# Altium project Proco RAT R1.PrjPcb
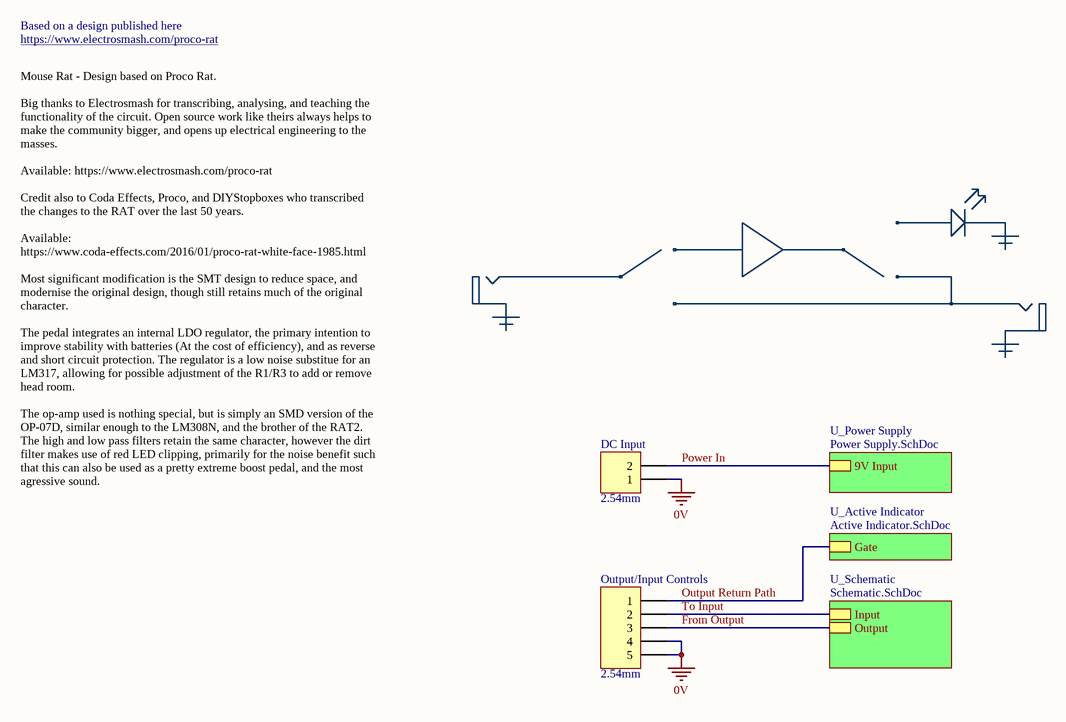
[diagram p0: Top Level.SchDoc]
4 sheets, 47 parts. Net scope: hierarchical (ports join the sheet entries above them; power ports are global).
Board file: PCB.PcbDoc
Sheets:
  Top Level.SchDoc
    U_Power Supply = Power Supply.SchDoc
    U_Schematic = Schematic.SchDoc
    U_Active Indicator = Active Indicator.SchDoc

## Sheet Top Level.SchDoc
size A4

### Parts
DC_Input  2.54mm  [TH 2.54mm Header 1x2]
Output/Input_Controls  2.54mm  [TH 2.54mm Header 1x5]

### Sub-sheets
U_Active Indicator = Active Indicator.SchDoc: Gate
U_Power Supply = Power Supply.SchDoc: 9V Input
U_Schematic = Schematic.SchDoc: Output, Input

### Nets
0V: DC_Input.1 Output/Input_Controls.4 Output/Input_Controls.5
From Output: Output/Input_Controls.3 ; sheet U_Schematic/Output
Output Return Path: Output/Input_Controls.1 ; sheet U_Active Indicator/Gate
Power In: DC_Input.2 ; sheet U_Power Supply/9V Input
To Input: Output/Input_Controls.2 ; sheet U_Schematic/Input

### Notes on the sheet
- https://www.electrosmash.com/proco-rat
- Based on a design published here
- Mouse Rat - Design based on Proco Rat.
  Big thanks to Electrosmash for transcribing, analysing, and teaching the functionality of the circuit. Open source work like theirs always helps to make the community bigger, and opens up electrical engineering to the masses.
  Available: https://www.electrosmash.com/proco-rat
  Credit also to Coda Effects, Proco, and DIYStopboxes who transcribed the changes to the RAT over the last 50 years.
  Available: https://www.coda-effects.com/2016/01/proco-rat-white-face-1985.html
  Most significant modification is the SMT design to reduce space, and modernise the original design, though still retains much of the original character.
  The pedal integrates an internal LDO regulator, the primary intention to improve stability with batteries (At the cost of efficiency), and as reverse and short circuit protection. The regulator is a low noise substitue for an LM317, allowing for possible adjustment of the R1/R3 to add or remove head room.
  The op-amp used is nothing special, but is simply an SMD version of the OP-07D, similar enough to the LM308N, and the brother of the RAT2. The high and low pass filters retain the same character, however the dirt filter makes use of red LED clipping, primarily for the noise benefit such that this can also be used as a pretty extreme boost pedal, and the most agressive sound.

### Library data of the parts
DC_Input = TH 2.54mm Header 1x2: Positions: 2; Angle: 0; Flange: No; Contact: NA; Part Number: TH 2.54mm Header 1x2; Pitch: 2.54mm; Row Spacing: 2.54mm
Output/Input_Controls = TH 2.54mm Header 1x5: Positions: 5; Angle: 0; Flange: No; Contact: NA; Part Number: TH 2.54mm Header 1x5; Pitch: 2.54mm; Row Spacing: 2.54mm

## Sheet Power Supply.SchDoc
size A4
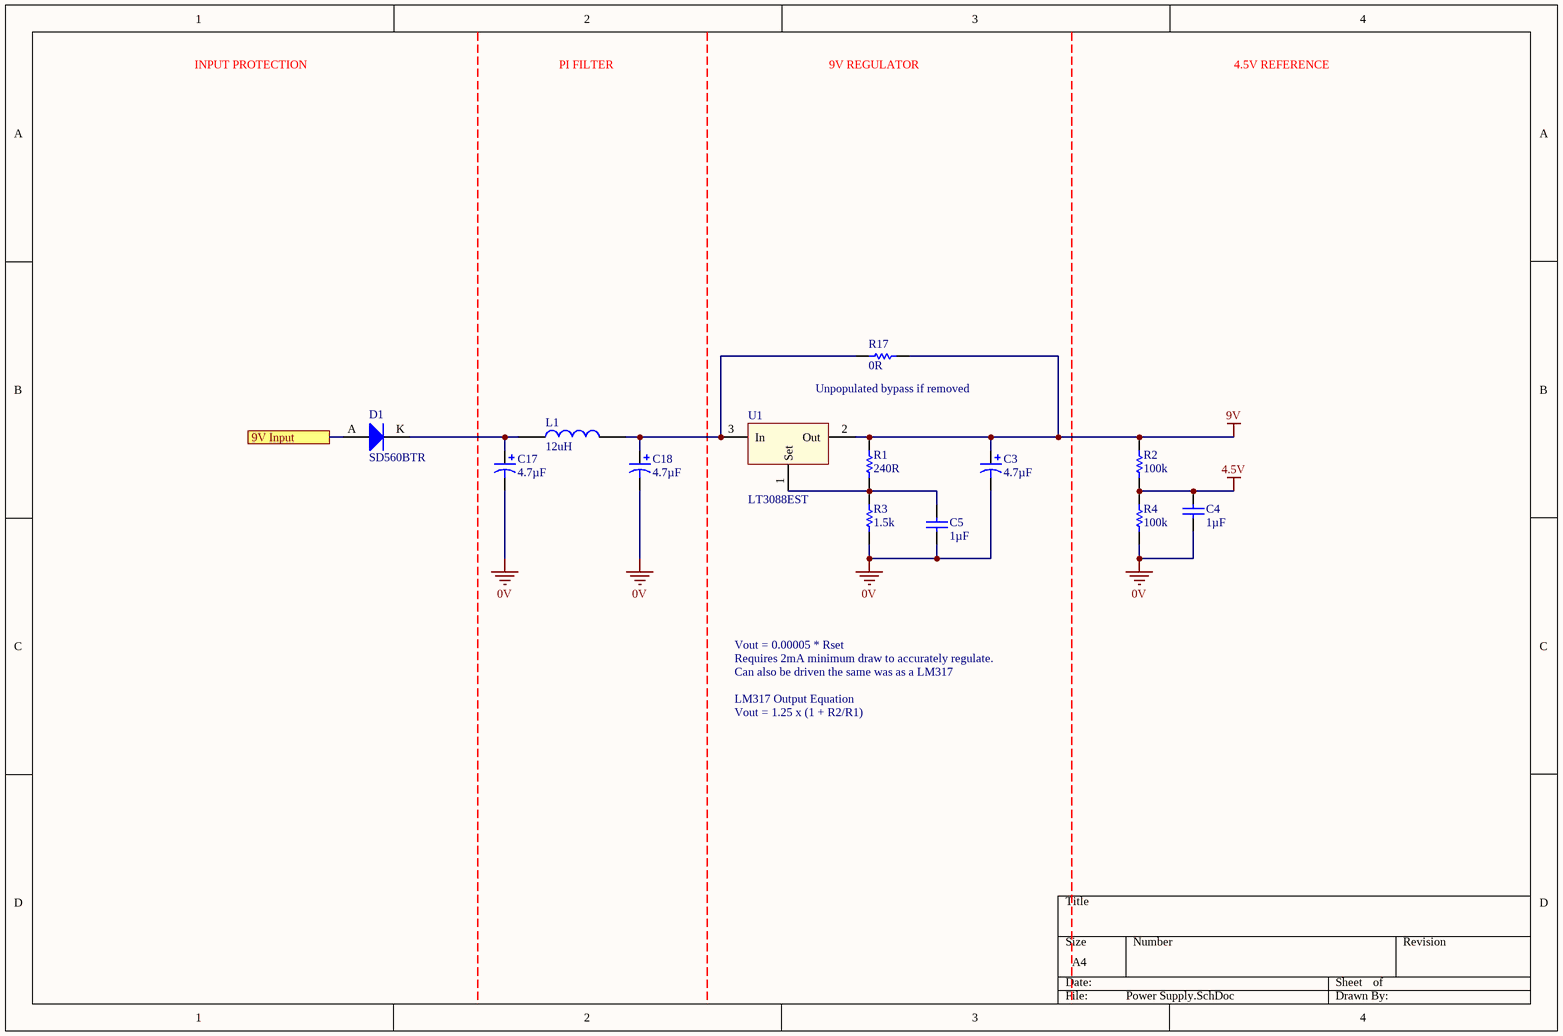
[diagram p1: Power Supply.SchDoc]

### Parts
C3  4.7µF  [1206]
C4  1µF  [0805]
C5  1µF  [0805]
C17  4.7µF  [1206]
C18  4.7µF  [1206]
D1  SD560BTR  [SMB Diode]
L1  12uH  [1812]
R1  240R  [0805]
R2  100k  [0805]
R3  1.5k  [0805]
R4  100k  [0805]
R17  0R  [0805]
U1  LT3088EST  [LT SOT-223]

### Ports
9V Input

### Nets
0V: C3.1 C4.1 C5.1 C17.1 C18.1 R3.1 R4.1
4.5V: C4.2 R2.1 R4.2
9V: C3.2 R1.2 R2.2 R17.2 U1.2(Out)
Power In: D1.A ; port 9V Input
NetC5_2: C5.2 R1.1 R3.2 U1.1(Set)
NetC17_2: C17.2 D1.K L1.2
NetC18_2: C18.2 L1.1 R17.1 U1.3(In)

### Notes on the sheet
- INPUT PROTECTION
- PI FILTER
- 9V REGULATOR
- 4.5V REFERENCE
- Unpopulated bypass if removed
- Vout = 0.00005 * Rset
- LM317 Output Equation
- Vout = 1.25 x (1 + R2/R1)
- Can also be driven the same was as a LM317
- Requires 2mA minimum draw to accurately regulate.

### Library data of the parts
C3 C17 C18 = TAJA475K025RNJ: Manufacturer: AVX Corporation; Tolerance: ±10%; Material: Tantalum; Rated Voltage: 25V; Part Number: TAJA475K025RNJ; Value: 4.7µF; Digikey Part Number: 478-11053-1-ND
C4 C5 = GCM21BR71H105KA03L: Manufacturer: muRata; Tolerance: ±10%; Material: X7R; Rated Voltage: 50V; Part Number: GCM21BR71H105KA03L; Value: 1µF; Digikey Part Number: 490-10675-1-ND
D1 = SD560BTR: 1.2V_F 600V 5A SMB; Manufacturer: SMC Diode Solutions; Part Number: SD560BTR; Digikey Part Number: 1655-1530-2-ND; Digikey Link: https://www.digikey.com/product-detail/en/smc-diode-solutions/SD560BTR/1655-1530-2-ND/6022620
L1 = RLS-126: Manufacturer: Recom; Impedence: 230mOhm; Tolerance: 0.2; Material: Wirewound; Rated Current: 800mA; Part Number: RLS-126; Value: 12uH; Digikey Part Number: 945-3429-ND
R1 = RC0805FR07240RL: Manufacturer: YAGEO; Tolerance: 0.01; Rated Voltage: 0.125W; Part Number: RC0805FR07240RL; Value: 240R; Material: FR-07; Digikey Part Number: 311-240CRCT-ND
R2 R4 = RC0805FR07100KL: Manufacturer: YAGEO; Tolerance: 0.01; Rated Voltage: 0.125W; Part Number: RC0805FR07100KL; Value: 100k; Material: FR-07; Digikey Part Number: 311-100KCRCT-ND
R3 = RC0805FR071K5L: Manufacturer: YAGEO; Tolerance: 0.01; Rated Voltage: 0.125W; Part Number: RC0805FR071K5L; Value: 1.5k; Material: FR-07; Digikey Part Number: 311-1.50KCRCT-ND
R17 = RC0805FR070RL: Manufacturer: YAGEO; Tolerance: 0.01; Rated Voltage: 0.125W; Part Number: RC0805FR070RL; Value: 0R; Material: FR-07; Digikey Part Number: 311-0.0CRCT-ND
U1 = LT3088EST: Linear Voltage Regulator IC Output 800mA SOT-223-3; Manufacturer: Linear Technologies; Input Voltage: 1.6V-36V; Output Voltage: 1.6V-34.5V; Efficiency: 0.5; Isolation: Non-Isolated; Part Number: LT3088EST; Output Power: 800mA; Digikey Part Number: LT3088EST#PBF-ND; Digikey Link: https://www.digikey.com/en/products/detail/analog-devices-inc/LT3088EST-PBF/5297582

## Sheet Schematic.SchDoc
size A4
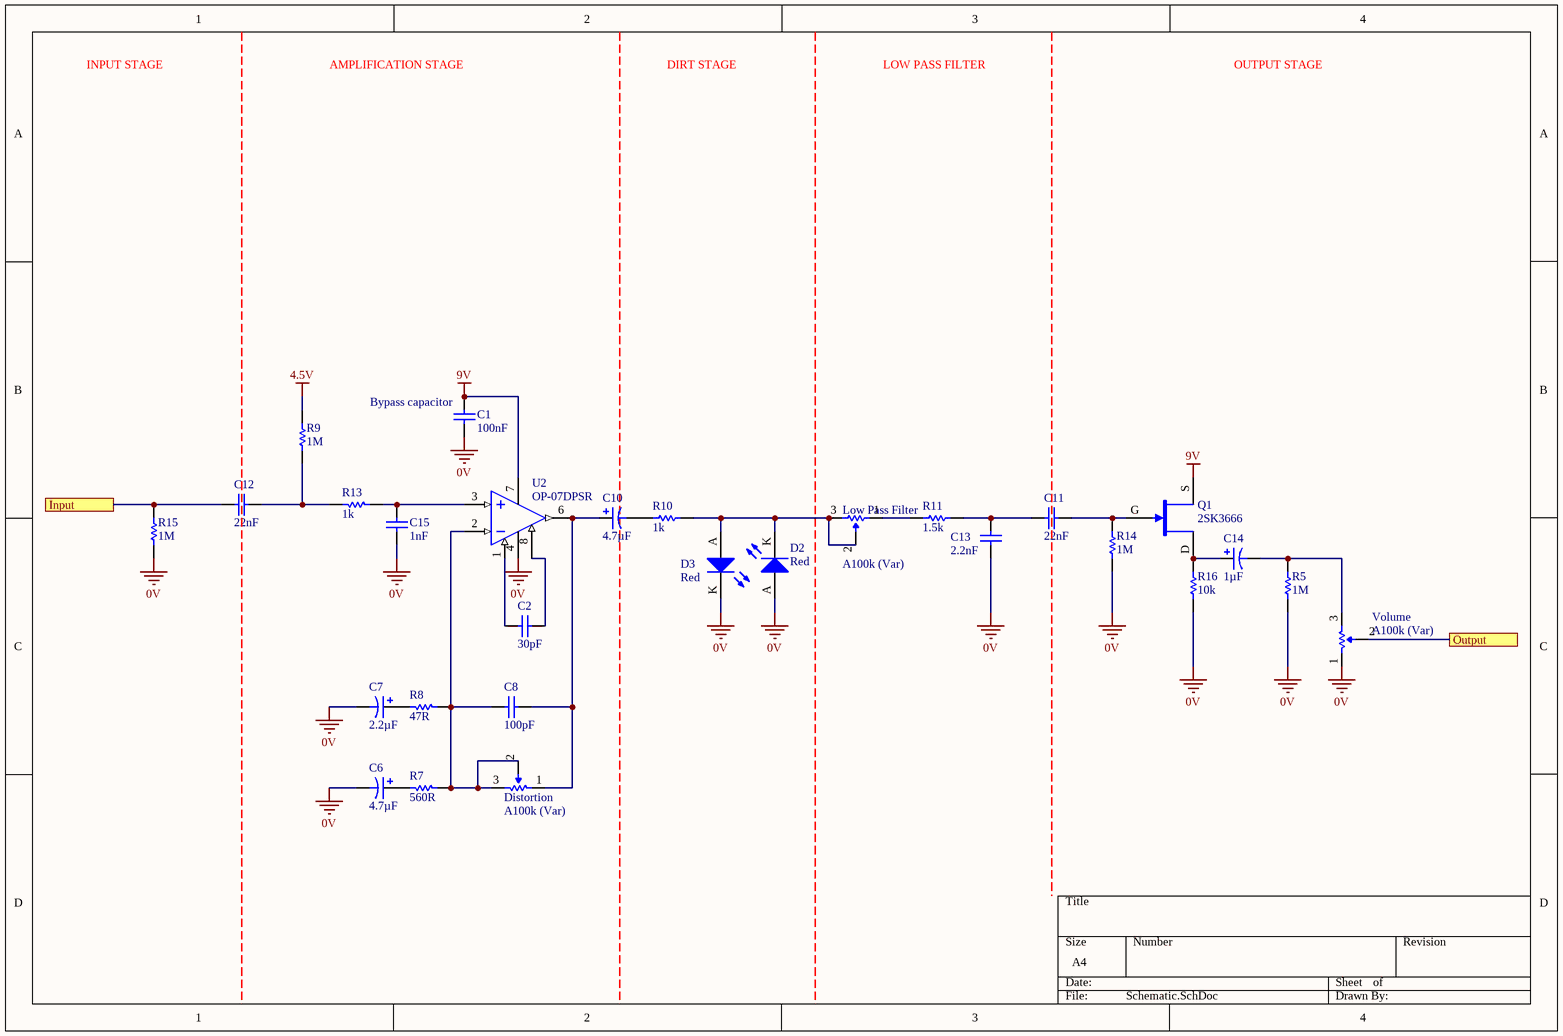
[diagram p2: Schematic.SchDoc]

### Parts
C1  100nF  [0805]
C2  30pF  [0805]
C6  4.7µF  [1206]
C7  2.2µF  [1206]
C8  100pF  [0805]
C10  4.7µF  [1206]
C11  22nF  [0805]
C12  22nF  [0805]
C13  2.2nF  [0805]
C14  1µF  [1206]
C15  1nF  [0805]
D2  Red  [0805 LED]
D3  Red  [0805 LED]
Distortion  A100k (Var)  [16mm PCB Mount Pot]
Low_Pass_Filter  A100k (Var)  [16mm PCB Mount Pot]
Q1  2SK3666  [ON SOT-23 JFET]
R5  1M  [0805]
R7  560R  [0805]
R8  47R  [0805]
R9  1M  [0805]
R10  1k  [0805]
R11  1.5k  [0805]
R13  1k  [0805]
R14  1M  [0805]
R15  1M  [0805]
R16  10k  [0805]
U2  OP-07DPSR  [TI 8-SOIC-W]
Volume  A100k (Var)  [16mm PCB Mount Pot]

### Ports
Input, Output

### Nets
0V: C1.1 C6.1 C7.1 C13.1 C15.1 D2.A D3.K R5.1 R14.1 R15.1 R16.1 U2.4(VCC-) Volume.1(CCW)
4.5V: R9.2
9V: C1.2 Q1.S U2.7(VCC+)
From Output: Volume.2(Wiper) ; port Output
To Input: C12.1 R15.2 ; port Input
NetC2_1: C2.1 U2.1(OFFSET_N1)
NetC2_2: C2.2 U2.8(OFFSET_N2)
NetC6_2: C6.2 R7.1
NetC7_2: C7.2 R8.1
NetC8_1: C8.1 Distortion.2(Wiper) Distortion.3(CW) R7.2 R8.2 U2.2(IN-)
NetC8_2: C8.2 C10.2 Distortion.1(CCW) U2.6(OUT)
NetC10_1: C10.1 R10.1
NetC11_1: C11.1 C13.2 R11.2
NetC11_2: C11.2 Q1.G R14.2
NetC12_2: C12.2 R9.1 R13.1
NetC14_1: C14.1 R5.2 Volume.3(CW)
NetC14_2: C14.2 Q1.D R16.2
NetC15_2: C15.2 R13.2 U2.3(IN+)
NetD2_K: D2.K D3.A Low_Pass_Filter.2(Wiper) Low_Pass_Filter.3(CW) R10.2
NetLow_Pass_Filter_1: Low_Pass_Filter.1(CCW) R11.1

### Notes on the sheet
- INPUT STAGE
- AMPLIFICATION STAGE
- DIRT STAGE
- LOW PASS FILTER
- OUTPUT STAGE
- (near C1) Bypass capacitor

### Library data of the parts
C1 = GCM21BR71H104KA37L: Manufacturer: muRata; Tolerance: ±10%; Material: X7R; Rated Voltage: 50V; Part Number: GCM21BR71H104KA37L; Value: 100nF; Digikey Part Number: 490-6064-1-ND
C2 = GCM21B5C1H300JA37L: Manufacturer: muRata; Tolerance: 5%; Material: C0G; Rated Voltage: 50V; Part Number: GCM21B5C1H300JA37L; Value: 30pF; Digikey Part Number: DO NOT USE FOR NEW DESIGNS
C6 C10 = TAJA475K025RNJ: as C3 on sheet Power Supply; Part Number: TAJA475K025RNJ; Value: 4.7µF; Digikey Part Number: 478-11053-1-ND
C7 = TAJA225K025RNJ: Manufacturer: AVX Corporation; Tolerance: ±10%; Material: Tantalum; Rated Voltage: 25V; Part Number: TAJA225K025RNJ; Value: 2.2µF; Digikey Part Number: 478-1662-1-ND
C8 = GCM2165C1H101JA16D: Manufacturer: muRata; Tolerance: ±5%; Material: C0G, NP0; Rated Voltage: 50V; Part Number: GCM2165C1H101JA16D; Value: 100pF; Digikey Part Number: 490-8031-1-ND
C11 C12 = GCM21B5C1H223JA16L: Manufacturer: muRata; Tolerance: ±5%; Material: C0G, NP0; Rated Voltage: 50V; Part Number: GCM21B5C1H223JA16L; Value: 22nF; Digikey Part Number: 490-5318-1-ND
C13 = GCM2165C1H222JA16D: Manufacturer: muRata; Tolerance: ±5%; Material: C0G, NP0; Rated Voltage: 50V; Part Number: GCM2165C1H222JA16D; Value: 2.2nF; Digikey Part Number: 490-8033-1-ND
C14 = TAJA105K025RNJ: Manufacturer: AVX Corporation; Tolerance: ±10%; Material: Tantalum; Rated Voltage: 25V; Part Number: TAJA105K025RNJ; Value: 1µF; Digikey Part Number: 478-2363-1-ND
C15 = GCM2165C1H102JA16D: Manufacturer: muRata; Tolerance: ±5%; Material: C0G, NP0; Rated Voltage: 50V; Part Number: GCM2165C1H102JA16D; Value: 1nF; Digikey Part Number: 490-8032-1-ND
D2 D3 = SML-210LTT86: Red LED Indication - Discrete 1.75V 0805 (2012 Metric); Manufacturer: ROHM Semiconductor; Part Number: SML-210LTT86; Colour: Red; Digikey Part Number: 511-1286-1-ND; Digikey Link: https://www.digikey.com/product-detail/en/rohm-semiconductor/SML-210LTT86/511-1286-1-ND/637099
Distortion Low_Pass_Filter Volume = 502-0317: Manufacturer: NTE Electronics; Tolerance: 0.2; Rated Voltage: 0.1W; Part Number: 502-0317; Value: A100k (Var); Digikey Part Number: 2368-502-0317-ND
Q1 = 2SK3666: JFET N-Channel 10mA 200mW Surface Mount 3-CP; Manufacturer: ON Semiconductor; Published: 24-Mar-1999; LatestRevisionDate: 29-May-2009; LatestRevisionNote: IPC-7351 Footprint Added.; PackageVersion: Sep-2000; PackageReference: SOT-343; Publisher: Altium Limited; PackageDescription: 4-Pin SOT-343 Package 1.3 mm Pitch, 2.1 mm Lead Span; Part Number: 2SK3666; Digikey Part Number: 869-1107-1-ND; Digikey Link: https://www.digikey.com/product-detail/en/on-semiconductor/2SK3666-3-TB-E/869-1107-1-ND/2165585
R5 R9 R14 R15 = RC0805FR071ML: Manufacturer: YAGEO; Tolerance: 0.01; Rated Voltage: 0.125W; Part Number: RC0805FR071ML; Value: 1M; Material: FR-07; Digikey Part Number: 311-1.00MCRCT-ND
R7 = RC0805FR07560RL: Manufacturer: YAGEO; Tolerance: 0.01; Rated Voltage: 0.125W; Part Number: RC0805FR07560RL; Value: 560R; Material: FR-07; Digikey Part Number: 311-560CRCT-ND
R8 = RC0805FR0747RL: Manufacturer: YAGEO; Tolerance: 0.01; Rated Voltage: 0.125W; Part Number: RC0805FR0747RL; Value: 47R; Material: FR-07; Digikey Part Number: 311-47.0CRCT-ND
R10 R13 = RC0805FR071KL: Manufacturer: YAGEO; Tolerance: 0.01; Rated Voltage: 0.125W; Part Number: RC0805FR071KL; Value: 1k; Material: FR-07; Digikey Part Number: 311-1.00KCRCT-ND
R11 = RC0805FR071K5L: as R3 on sheet Power Supply; Part Number: RC0805FR071K5L; Value: 1.5k; Material: FR-07; Digikey Part Number: 311-1.50KCRCT-ND
R16 = RC0805FR0710KL: Manufacturer: YAGEO; Tolerance: 0.01; Rated Voltage: 0.125W; Part Number: RC0805FR0710KL; Value: 10k; Material: FR-07; Digikey Part Number: 311-10.0KCRCT-ND
U2 = OP-07DPSR: General Purpose Amplifier 1 Circuit 8-SO; Manufacturer: Texas Instruments; Part Number: OP-07DPSR; Digikey Part Number: 296-14171-2-ND; Digikey Link: https://www.digikey.com/product-detail/en/texas-instruments/OP-07DPSR/296-14171-2-ND/525998

## Sheet Active Indicator.SchDoc
size A4
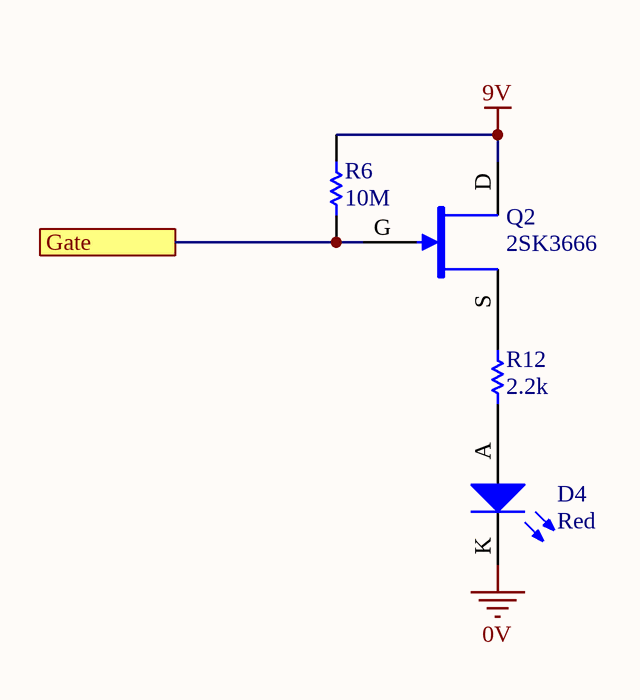
[diagram p3: Active Indicator.SchDoc]

### Parts
D4  Red  [0805 LED]
Q2  2SK3666  [ON SOT-23 JFET]
R6  10M  [0805]
R12  2.2k  [0805]

### Ports
Gate

### Nets
0V: D4.K
9V: Q2.D R6.2
Output Return Path: Q2.G R6.1 ; port Gate
NetD4_A: D4.A R12.1
NetQ2_S: Q2.S R12.2

### Library data of the parts
D4 = SML-210LTT86: as D2 on sheet Schematic; Part Number: SML-210LTT86; Colour: Red; Digikey Part Number: 511-1286-1-ND; Digikey Link: https://www.digikey.com/product-detail/en/rohm-semiconductor/SML-210LTT86/511-1286-1-ND/637099
Q2 = 2SK3666: as Q1 on sheet Schematic; Published: 24-Mar-1999; LatestRevisionDate: 29-May-2009; LatestRevisionNote: IPC-7351 Footprint Added.; PackageVersion: Sep-2000; PackageReference: SOT-343; Publisher: Altium Limited; PackageDescription: 4-Pin SOT-343 Package 1.3 mm Pitch, 2.1 mm Lead Span; Part Number: 2SK3666; Digikey Part Number: 869-1107-1-ND; Digikey Link: https://www.digikey.com/product-detail/en/on-semiconductor/2SK3666-3-TB-E/869-1107-1-ND/2165585
R6 = RC0805FR0710ML: Manufacturer: YAGEO; Tolerance: 0.01; Rated Voltage: 0.125W; Part Number: RC0805FR0710ML; Value: 10M; Material: FR-07; Digikey Part Number: 311-10.0MCRCT-ND
R12 = RC0805FR072K2L: Manufacturer: YAGEO; Tolerance: 0.01; Rated Voltage: 0.125W; Part Number: RC0805FR072K2L; Value: 2.2k; Material: FR-07; Digikey Part Number: 311-2.20KCRCT-ND

## Nets that join several sheets
0V: Top Level (DC_Input.1 Output/Input_Controls.4 Output/Input_Controls.5), Power Supply (7 pins), Schematic (13 pins), Active Indicator (D4.K)
4.5V: Power Supply (C4.2 R2.1 R4.2), Schematic (R9.2)
9V: Power Supply (5 pins), Schematic (C1.2 Q1.S U2.7), Active Indicator (Q2.D R6.2)
From Output: Top Level (Output/Input_Controls.3), Schematic (Volume.2)
Output Return Path: Top Level (Output/Input_Controls.1), Active Indicator (Q2.G R6.1)
Power In: Top Level (DC_Input.2), Power Supply (D1.A)
To Input: Top Level (Output/Input_Controls.2), Schematic (C12.1 R15.2)